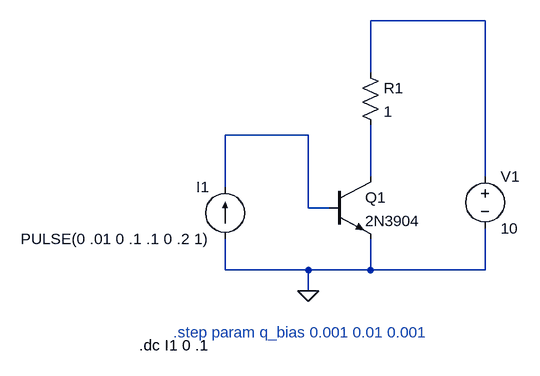
[diagram p0: schematic npn.asc]
npn.asc, the LTspice schematic file:
Version 4
SHEET 1 880 680
WIRE 512 -80 336 -80
WIRE 336 0 336 -80
WIRE 240 96 112 96
WIRE 336 160 336 80
WIRE 512 160 512 -80
WIRE 112 176 112 96
WIRE 240 208 240 96
WIRE 272 208 240 208
WIRE 112 304 112 256
WIRE 240 304 112 304
WIRE 336 304 336 256
WIRE 336 304 240 304
WIRE 512 304 512 240
WIRE 512 304 336 304
WIRE 240 336 240 304
FLAG 240 336 0
SYMBOL current 112 256 R180
WINDOW 0 24 80 Left 2
WINDOW 3 24 0 Left 2
WINDOW 123 0 0 Left 2
WINDOW 39 0 0 Left 2
SYMATTR InstName I1
SYMATTR Value PULSE(0 .01 0 .1 .1 0 .2 1)
SYMBOL npn 272 160 R0
SYMATTR InstName Q1
SYMATTR Value 2N3904
SYMBOL voltage 512 144 R0
WINDOW 123 0 0 Left 2
WINDOW 39 0 0 Left 2
SYMATTR InstName V1
SYMATTR Value 10
SYMBOL res 320 -16 R0
SYMATTR InstName R1
SYMATTR Value 1
TEXT 32 400 Left 2 ;.step param q_bias 0.001 0.01 0.001
TEXT -20 420 Left 2 !.dc I1 0 .1

The netlist it stands for:
* npn.asc
I1 0 N002 PULSE(0 .01 0 .1 .1 0 .2 1)
Q1 N003 N002 0 0 2N3904
V1 N001 0 10
R1 N001 N003 1
.model NPN NPN
.model PNP PNP
.lib standard.bjt
* .step param q_bias 0.001 0.01 0.001
.dc I1 0 .1
.backanno
.end